# Altium project Remote_Control.PrjPcb
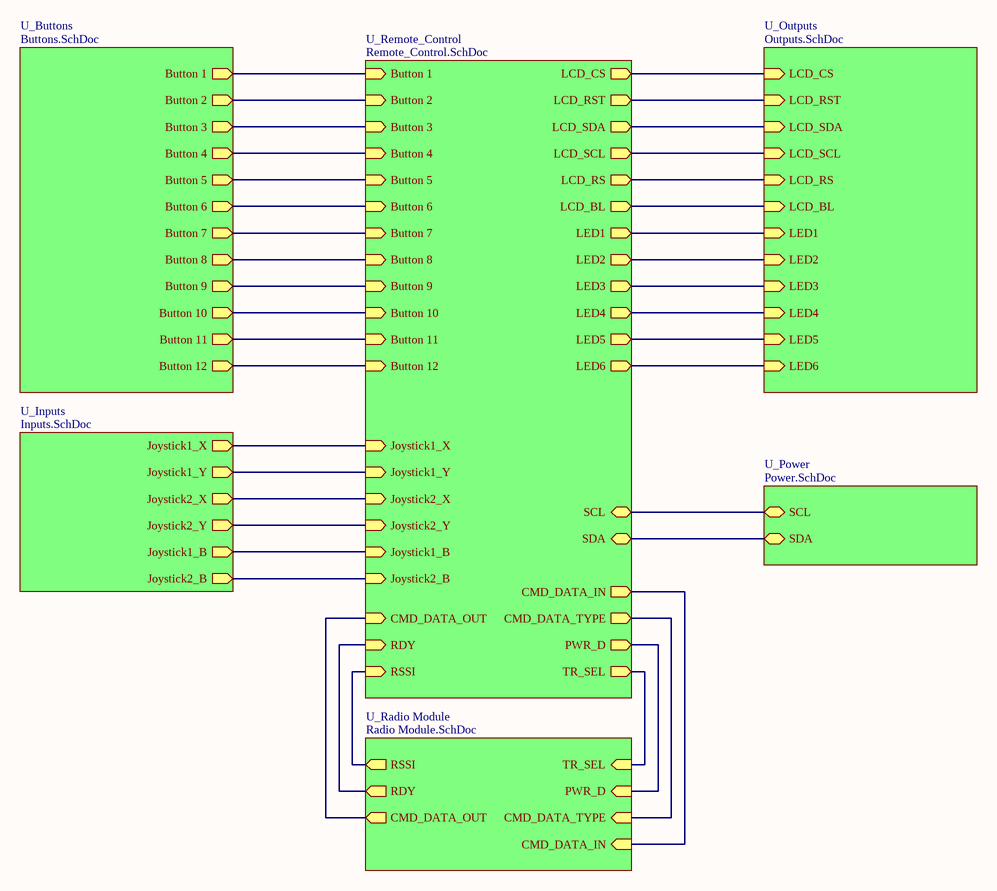
[diagram p0: Remote_Control_Top.SchDoc]
7 sheets, 109 parts. Net scope: hierarchical (ports join the sheet entries above them; power ports are global).
Board files: Remote_Control.PcbDoc, Remote_Control_V2.PcbDoc
Sheets:
  Remote_Control_Top.SchDoc
    U_Buttons = Buttons.SchDoc
    U_Outputs = Outputs.SchDoc
    U_Radio Module = Radio Module.SchDoc
    U_Remote_Control = Remote_Control.SchDoc
    U_Power = Power.SchDoc
    U_Inputs = Inputs.SchDoc

## Sheet Remote_Control_Top.SchDoc
size Letter

### Sub-sheets
U_Buttons = Buttons.SchDoc: Button 1 (out), Button 3 (out), Button 5 (out), Button 2 (out), Button 4 (out), Button 6 (out), Button 7 (out), Button 8 (out), Button 9 (out), Button 10 (out), Button 11 (out), Button 12 (out)
U_Inputs = Inputs.SchDoc: Joystick1_X (out), Joystick1_Y (out), Joystick2_X (out), Joystick2_Y (out), Joystick2_B (out), Joystick1_B (out)
U_Outputs = Outputs.SchDoc: LCD_RS (in), LCD_SCL (in), LCD_SDA (in), LCD_RST (in), LCD_CS (in), LCD_BL (in), LED1 (in), LED2 (in), LED3 (in), LED4 (in), LED5 (in), LED6 (in)
U_Power = Power.SchDoc: SCL (bidir), SDA (bidir)
U_Radio Module = Radio Module.SchDoc: RSSI (out), RDY (out), TR_SEL (in), PWR_D (in), CMD_DATA_TYPE (in), CMD_DATA_OUT (out), CMD_DATA_IN (in)
U_Remote_Control = Remote_Control.SchDoc: Button 1 (in), Button 2 (in), Button 3 (in), Button 4 (in), Button 5 (in), Joystick1_X (in), Joystick1_Y (in), Joystick2_X (in), Joystick2_Y (in), Button 6 (in), LCD_CS (out), LCD_RST (out), LCD_SDA (out), LCD_SCL (out), LCD_RS (out), LCD_BL (out), LED1 (out), LED2 (out), LED3 (out), LED4 (out), LED5 (out), LED6 (out), Button 7 (in), Button 8 (in), Button 9 (in), Button 10 (in), Button 11 (in), Button 12 (in), RSSI (in), CMD_DATA_IN (out), CMD_DATA_OUT (in), CMD_DATA_TYPE (out), PWR_D (out), TR_SEL (out), RDY (in), SDA (bidir), SCL (bidir), Joystick1_B (in), Joystick2_B (in)

### Nets
EXSCL: sheet U_Remote_Control/SCL, sheet U_Power/SCL
EXSDA: sheet U_Remote_Control/SDA, sheet U_Power/SDA
NetC2_1: sheet U_Remote_Control/Joystick1_B, sheet U_Inputs/Joystick1_B
NetC3_1: sheet U_Remote_Control/Joystick2_B, sheet U_Inputs/Joystick2_B
NetC6_1: sheet U_Buttons/Button 2, sheet U_Remote_Control/Button 2
NetC12_1: sheet U_Buttons/Button 3, sheet U_Remote_Control/Button 3
NetC13_1: sheet U_Buttons/Button 4, sheet U_Remote_Control/Button 4
NetC14_1: sheet U_Buttons/Button 5, sheet U_Remote_Control/Button 5
NetC15_1: sheet U_Buttons/Button 11, sheet U_Remote_Control/Button 11
NetC16_1: sheet U_Buttons/Button 6, sheet U_Remote_Control/Button 6
NetC17_1: sheet U_Buttons/Button 7, sheet U_Remote_Control/Button 7
NetC18_1: sheet U_Buttons/Button 8, sheet U_Remote_Control/Button 8
NetC20_1: sheet U_Buttons/Button 9, sheet U_Remote_Control/Button 9
NetC21_1: sheet U_Buttons/Button 10, sheet U_Remote_Control/Button 10
NetC22_1: sheet U_Buttons/Button 12, sheet U_Remote_Control/Button 12
NetC23_1: sheet U_Buttons/Button 1, sheet U_Remote_Control/Button 1
NetR1_1: sheet U_Outputs/LED1, sheet U_Remote_Control/LED1
NetR2_1: sheet U_Outputs/LED2, sheet U_Remote_Control/LED2
NetR3_1: sheet U_Outputs/LED3, sheet U_Remote_Control/LED3
NetR5_1: sheet U_Outputs/LED4, sheet U_Remote_Control/LED4
NetR6_1: sheet U_Outputs/LED5, sheet U_Remote_Control/LED5
NetR7_1: sheet U_Outputs/LED6, sheet U_Remote_Control/LED6
NetR9_1: sheet U_Outputs/LCD_RST, sheet U_Remote_Control/LCD_RST
NetR11_1: sheet U_Outputs/LCD_BL, sheet U_Remote_Control/LCD_BL
NetU1_1: sheet U_Remote_Control/Joystick1_X, sheet U_Inputs/Joystick1_X
NetU1_6: sheet U_Remote_Control/Joystick1_Y, sheet U_Inputs/Joystick1_Y
NetU1_8: sheet U_Remote_Control/Joystick2_X, sheet U_Inputs/Joystick2_X
NetU1_13: sheet U_Remote_Control/Joystick2_Y, sheet U_Inputs/Joystick2_Y
NetU2_14: sheet U_Radio Module/RSSI, sheet U_Remote_Control/RSSI
NetU2_17: sheet U_Radio Module/PWR_D, sheet U_Remote_Control/PWR_D
NetU2_18: sheet U_Outputs/LCD_CS, sheet U_Remote_Control/LCD_CS
NetU2_20: sheet U_Outputs/LCD_RS, sheet U_Remote_Control/LCD_RS
NetU2_21: sheet U_Radio Module/TR_SEL, sheet U_Remote_Control/TR_SEL
NetU2_22: sheet U_Radio Module/RDY, sheet U_Remote_Control/RDY
NetU2_31: sheet U_Radio Module/CMD_DATA_OUT, sheet U_Remote_Control/CMD_DATA_OUT
NetU2_39: sheet U_Outputs/LCD_SCL, sheet U_Remote_Control/LCD_SCL
NetU2_41: sheet U_Outputs/LCD_SDA, sheet U_Remote_Control/LCD_SDA
NetU2_42: sheet U_Radio Module/CMD_DATA_IN, sheet U_Remote_Control/CMD_DATA_IN
NetU2_43: sheet U_Radio Module/CMD_DATA_TYPE, sheet U_Remote_Control/CMD_DATA_TYPE

## Sheet Buttons.SchDoc
size Letter
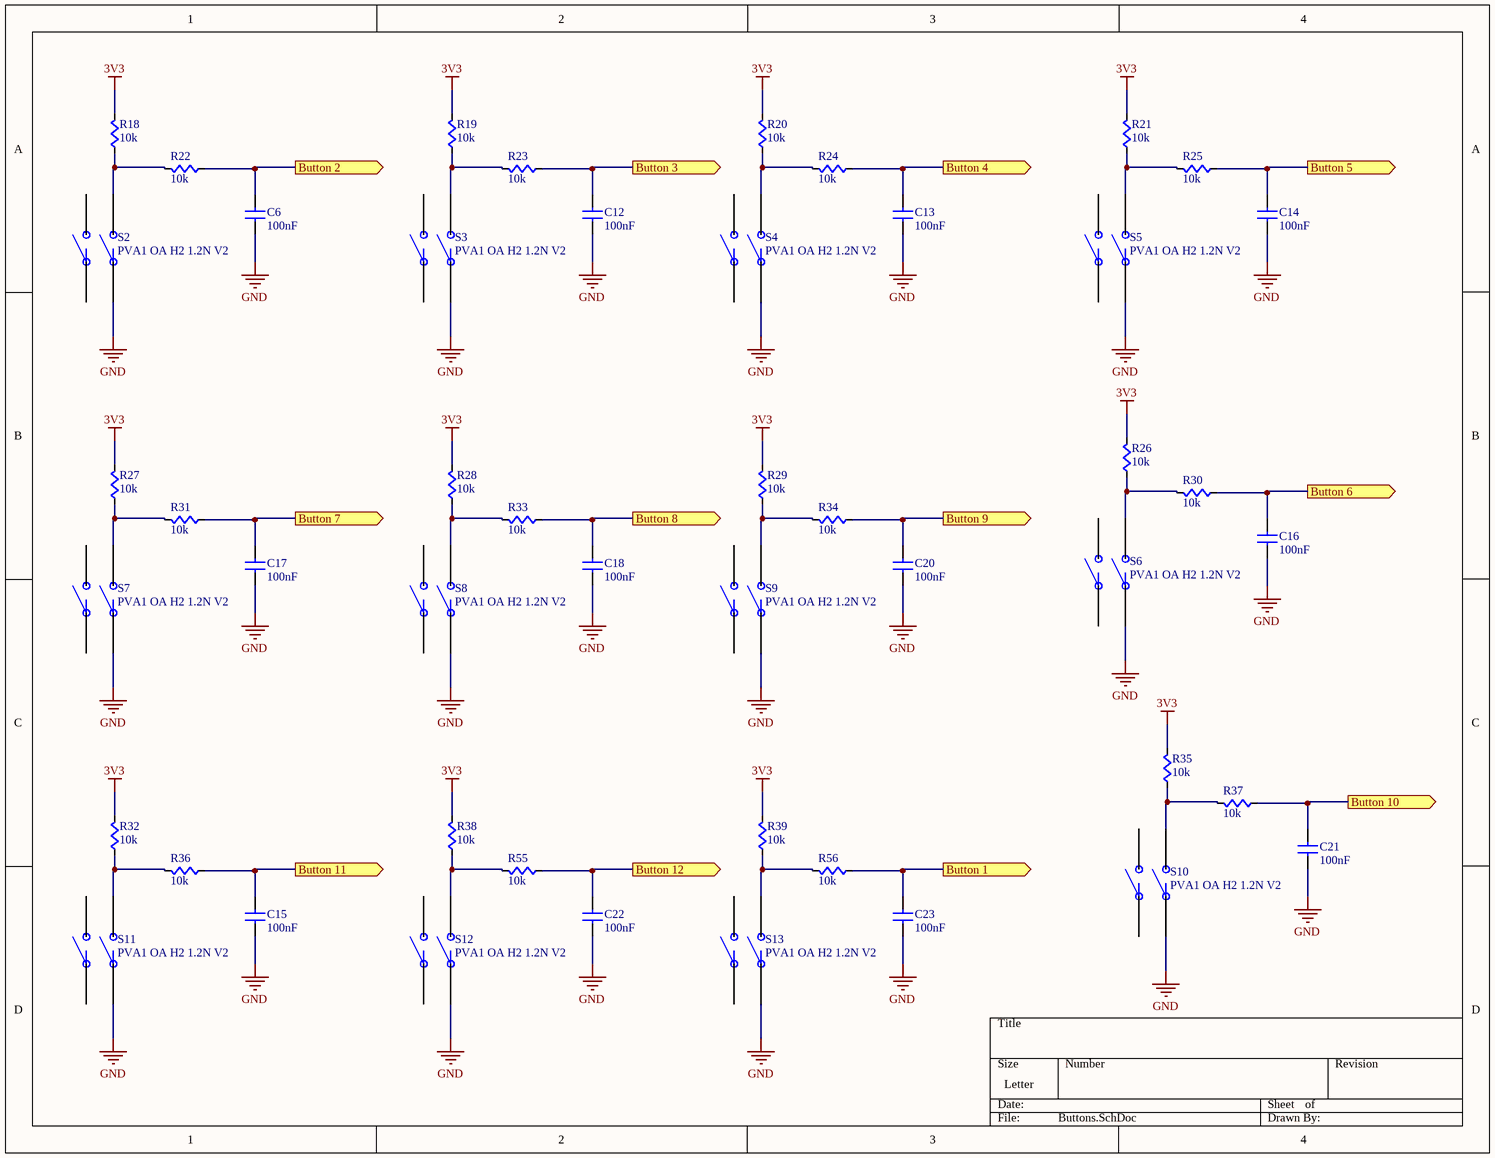
[diagram p1: Buttons.SchDoc]

### Parts
C6  value 100nF  [CAPC0603]  (hidden comment: Cap)
C12  value 100nF  [CAPC0603]  (hidden comment: Cap)
C13  value 100nF  [CAPC0603]  (hidden comment: Cap)
C14  value 100nF  [CAPC0603]  (hidden comment: Cap)
C15  value 100nF  [CAPC0603]  (hidden comment: Cap)
C16  value 100nF  [CAPC0603]  (hidden comment: Cap)
C17  value 100nF  [CAPC0603]  (hidden comment: Cap)
C18  value 100nF  [CAPC0603]  (hidden comment: Cap)
C20  value 100nF  [CAPC0603]  (hidden comment: Cap)
C21  value 100nF  [CAPC0603]  (hidden comment: Cap)
C22  value 100nF  [CAPC0603]  (hidden comment: Cap)
C23  value 100nF  [CAPC0603]  (hidden comment: Cap)
R18  value 10k  [RES0603]  (hidden comment: Res)
R19  value 10k  [RES0603]  (hidden comment: Res)
R20  value 10k  [RES0603]  (hidden comment: Res)
R21  value 10k  [RES0603]  (hidden comment: Res)
R22  value 10k  [RES0603]  (hidden comment: Res)
R23  value 10k  [RES0603]  (hidden comment: Res)
R24  value 10k  [RES0603]  (hidden comment: Res)
R25  value 10k  [RES0603]  (hidden comment: Res)
R26  value 10k  [RES0603]  (hidden comment: Res)
R27  value 10k  [RES0603]  (hidden comment: Res)
R28  value 10k  [RES0603]  (hidden comment: Res)
R29  value 10k  [RES0603]  (hidden comment: Res)
R30  value 10k  [RES0603]  (hidden comment: Res)
R31  value 10k  [RES0603]  (hidden comment: Res)
R32  value 10k  [RES0603]  (hidden comment: Res)
R33  value 10k  [RES0603]  (hidden comment: Res)
R34  value 10k  [RES0603]  (hidden comment: Res)
R35  value 10k  [RES0603]  (hidden comment: Res)
R36  value 10k  [RES0603]  (hidden comment: Res)
R37  value 10k  [RES0603]  (hidden comment: Res)
R38  value 10k  [RES0603]  (hidden comment: Res)
R39  value 10k  [RES0603]  (hidden comment: Res)
R55  value 10k  [RES0603]  (hidden comment: Res)
R56  value 10k  [RES0603]  (hidden comment: Res)
S2  PVA1 OA H2 1.2N V2  [PVA1 OA H2 1.2N V2]
S3  PVA1 OA H2 1.2N V2  [PVA1 OA H2 1.2N V2]
S4  PVA1 OA H2 1.2N V2  [PVA1 OA H2 1.2N V2]
S5  PVA1 OA H2 1.2N V2  [PVA1 OA H2 1.2N V2]
S6  PVA1 OA H2 1.2N V2  [PVA1 OA H2 1.2N V2]
S7  PVA1 OA H2 1.2N V2  [PVA1 OA H2 1.2N V2]
S8  PVA1 OA H2 1.2N V2  [PVA1 OA H2 1.2N V2]
S9  PVA1 OA H2 1.2N V2  [PVA1 OA H2 1.2N V2]
S10  PVA1 OA H2 1.2N V2  [PVA1 OA H2 1.2N V2]
S11  PVA1 OA H2 1.2N V2  [PVA1 OA H2 1.2N V2]
S12  PVA1 OA H2 1.2N V2  [PVA1 OA H2 1.2N V2]
S13  PVA1 OA H2 1.2N V2  [PVA1 OA H2 1.2N V2]

### Ports
Button 1 (out), Button 2 (out), Button 3 (out), Button 4 (out), Button 5 (out), Button 6 (out), Button 7 (out), Button 8 (out), Button 9 (out), Button 10 (out), Button 11 (out), Button 12 (out)

### Nets
3V3: R18.1(A) R19.1(A) R20.1(A) R21.1(A) R26.1(A) R27.1(A) R28.1(A) R29.1(A) R32.1(A) R35.1(A) R38.1(A) R39.1(A)
GND: C6.2(B) C12.2(B) C13.2(B) C14.2(B) C15.2(B) C16.2(B) C17.2(B) C18.2(B) C20.2(B) C21.2(B) C22.2(B) C23.2(B) S2.3 S3.3 S4.3 S5.3 S6.3 S7.3 S8.3 S9.3 S10.3 S11.3 S12.3 S13.3
NetC6_1: C6.1(A) R22.2(B) ; port Button 2
NetC12_1: C12.1(A) R23.2(B) ; port Button 3
NetC13_1: C13.1(A) R24.2(B) ; port Button 4
NetC14_1: C14.1(A) R25.2(B) ; port Button 5
NetC15_1: C15.1(A) R36.2(B) ; port Button 11
NetC16_1: C16.1(A) R30.2(B) ; port Button 6
NetC17_1: C17.1(A) R31.2(B) ; port Button 7
NetC18_1: C18.1(A) R33.2(B) ; port Button 8
NetC20_1: C20.1(A) R34.2(B) ; port Button 9
NetC21_1: C21.1(A) R37.2(B) ; port Button 10
NetC22_1: C22.1(A) R55.2(B) ; port Button 12
NetC23_1: C23.1(A) R56.2(B) ; port Button 1
NetR18_2: R18.2(B) R22.1(A) S2.4
NetR19_2: R19.2(B) R23.1(A) S3.4
NetR20_2: R20.2(B) R24.1(A) S4.4
NetR21_2: R21.2(B) R25.1(A) S5.4
NetR26_2: R26.2(B) R30.1(A) S6.4
NetR27_2: R27.2(B) R31.1(A) S7.4
NetR28_2: R28.2(B) R33.1(A) S8.4
NetR29_2: R29.2(B) R34.1(A) S9.4
NetR32_2: R32.2(B) R36.1(A) S11.4
NetR35_2: R35.2(B) R37.1(A) S10.4
NetR38_2: R38.2(B) R55.1(A) S12.4
NetR39_2: R39.2(B) R56.1(A) S13.4

Not connected (* = marked no-connect by the designer): S2 1 2; S3 1 2; S4 1 2; S5 1 2; S6 1 2; S7 1 2; S8 1 2; S9 1 2; S10 1 2; S11 1 2; S12 1 2; S13 1 2

### Library data of the parts
S2-S13 = PVA1 OA H2 1.2N V2: Pushbutton Switch DPST-NO Keyswitch Through Hole; Manufacturer: C&K; Supplier 1: Digi-Key; Supplier Part Number 1: 401-1135-ND; Manufacturer Part Number: PVA1 OA H2 1.2N V2; ComponentLink1URL: https://www.ckswitches.com/media/1343/pva.pdf; ComponentLink1Description: Datasheet; ComponentLink2URL: *
C6 C12-C18 C20-C23 = Cap: Supplier 1: Digi-Key; Supplier Part Number 1: 1276-1000-1-ND
R18-R39 R55 R56 = Res: Supplier 1: Digi-Key; Supplier Part Number 1: RMCF0603FT10K0CT-ND

## Sheet Outputs.SchDoc
size Letter
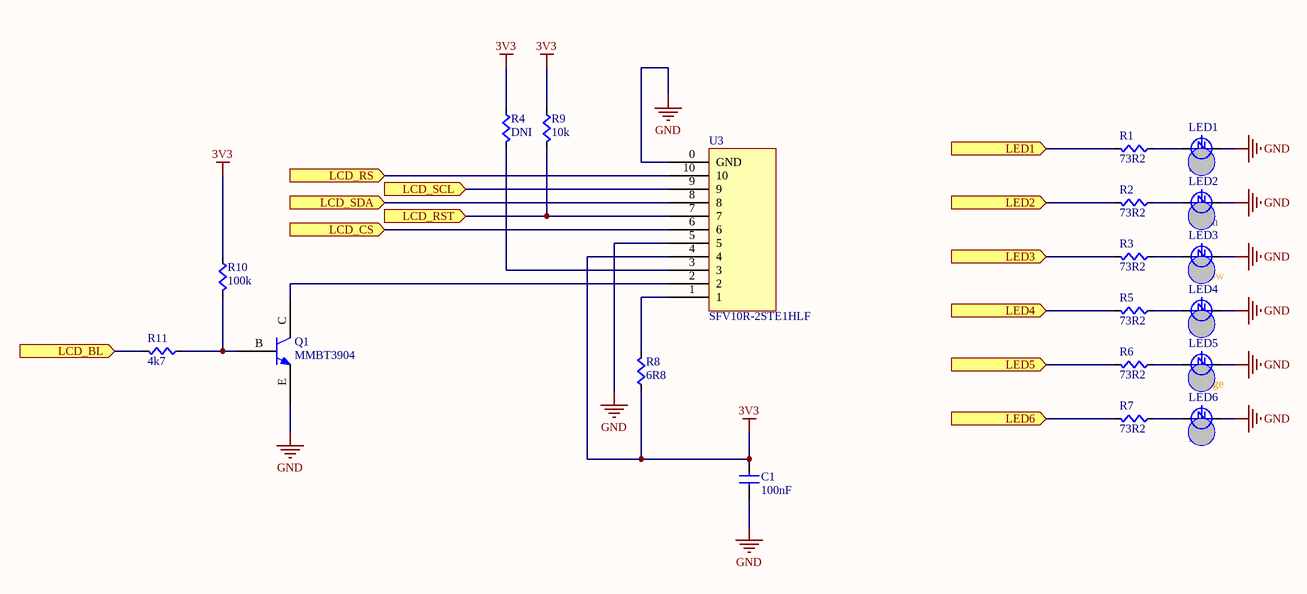
[diagram p2: Outputs.SchDoc]

### Parts
C1  value 100nF  [CAPC0603]  (hidden comment: Cap)
LED1  Color: Red  [LED0603]  (hidden comment: LED)
LED2  Color: Green  [LED0603]  (hidden comment: LED)
LED3  Color: Yellow  [LED0603]  (hidden comment: LED)
LED4  Color: Pink  [LED0603]  (hidden comment: LED)
LED5  Color: Orange  [LED0603]  (hidden comment: LED)
LED6  Color: Blue  [LED0603]  (hidden comment: LED)
Q1  MMBT3904  [MMBT3904]
R1  value 73R2  [RES0603]  (hidden comment: Res)
R2  value 73R2  [RES0603]  (hidden comment: Res)
R3  value 73R2  [RES0603]  (hidden comment: Res)
R4  value DNI  [RES0603]  (hidden comment: Res)
R5  value 73R2  [RES0603]  (hidden comment: Res)
R6  value 73R2  [RES0603]  (hidden comment: Res)
R7  value 73R2  [RES0603]  (hidden comment: Res)
R8  value 6R8  [RES0603]  (hidden comment: Res)
R9  value 10k  [RES0603]  (hidden comment: Res)
R10  value 100k  [RES0603]  (hidden comment: Res)
R11  value 4k7  [RES0603]  (hidden comment: Res)
U3  SFV10R-2STE1HLF  [SFV10R-2STE1HLF]

### Ports
LCD_BL (in), LCD_CS (in), LCD_RS (in), LCD_RST (in), LCD_SCL (in), LCD_SDA (in), LED1 (in), LED2 (in), LED3 (in), LED4 (in), LED5 (in), LED6 (in)

### Nets
3V3: C1.1(A) R4.2(B) R8.2(B) R9.2(B) R10.2(B) U3.4
GND: C1.2(B) LED1.C LED2.C LED3.C LED4.C LED5.C LED6.C Q1.E U3.0(GND) U3.5
NetLED1_A: LED1.A R1.2(B)
NetLED2_A: LED2.A R2.2(B)
NetLED3_A: LED3.A R3.2(B)
NetLED4_A: LED4.A R5.2(B)
NetLED5_A: LED5.A R6.2(B)
NetLED6_A: LED6.A R7.2(B)
NetQ1_B: Q1.B R10.1(A) R11.2(B)
NetQ1_C: Q1.C U3.2
NetR1_1: R1.1(A) ; port LED1
NetR2_1: R2.1(A) ; port LED2
NetR3_1: R3.1(A) ; port LED3
NetR4_1: R4.1(A) U3.3
NetR5_1: R5.1(A) ; port LED4
NetR6_1: R6.1(A) ; port LED5
NetR7_1: R7.1(A) ; port LED6
NetR8_1: R8.1(A) U3.1
NetR9_1: R9.1(A) U3.7 ; port LCD_RST
NetR11_1: R11.1(A) ; port LCD_BL
NetU2_18: U3.6 ; port LCD_CS
NetU2_20: U3.10 ; port LCD_RS
NetU2_39: U3.9 ; port LCD_SCL
NetU2_41: U3.8 ; port LCD_SDA

### Library data of the parts
Q1 = MMBT3904: TRANS NPN 40V 0.2A SOT-23; Manufacturer 1: Fairchild Semiconductor; Supplier 1: Digi-Key; Supplier Part Number 1: MMBT3904FSCT-ND; Manufacturer Part Number 1: MMBT3904
U3 = SFV10R-2STE1HLF: CONN FFC TOP 10POS 0.50MM R/A; Manufacturer 1: Amphenol FCI; Manufacturer Part Number 1: SFV10R-2STE1HLF; Supplier Part Number 1: 609-4306-1-ND; Supplier 1: Digi-Key; ComponentLink1URL: https://cdn.amphenol-icc.com/media/wysiwyg/files/drawing/10112793.pdf; ComponentLink1Description: "Datasheet"; ComponentLink2URL: https://www.digikey.com/product-detail/en/amphenol-fci/SFV10R-2STE1HLF/609-4306-1-ND/2626757
C1 = Cap: Supplier 1: Digi-Key; Supplier Part Number 1: 1276-1000-1-ND
LED1-LED6 = LED: Supplier 1: Digi-Key; Supplier Part Number 1: 754-1122-1-ND
R1-R11 = Res: Supplier 1: Digi-Key
  R1-R3 R5-R7: Supplier Part Number 1: RMCF0603FT73R2CT-ND
  R4: Supplier Part Number 1: RMCF0603JT10K0CT-ND
  R8: Supplier Part Number 1: RMCF0603FT6R80CT-ND
  R9: Supplier Part Number 1: RMCF0603FT10K0CT-ND
  R10: Supplier Part Number 1: RMCF0603FG100KCT-ND
  R11: Supplier Part Number 1: RMCF0603FT4K70CT-ND

## Sheet Radio Module.SchDoc
size Letter
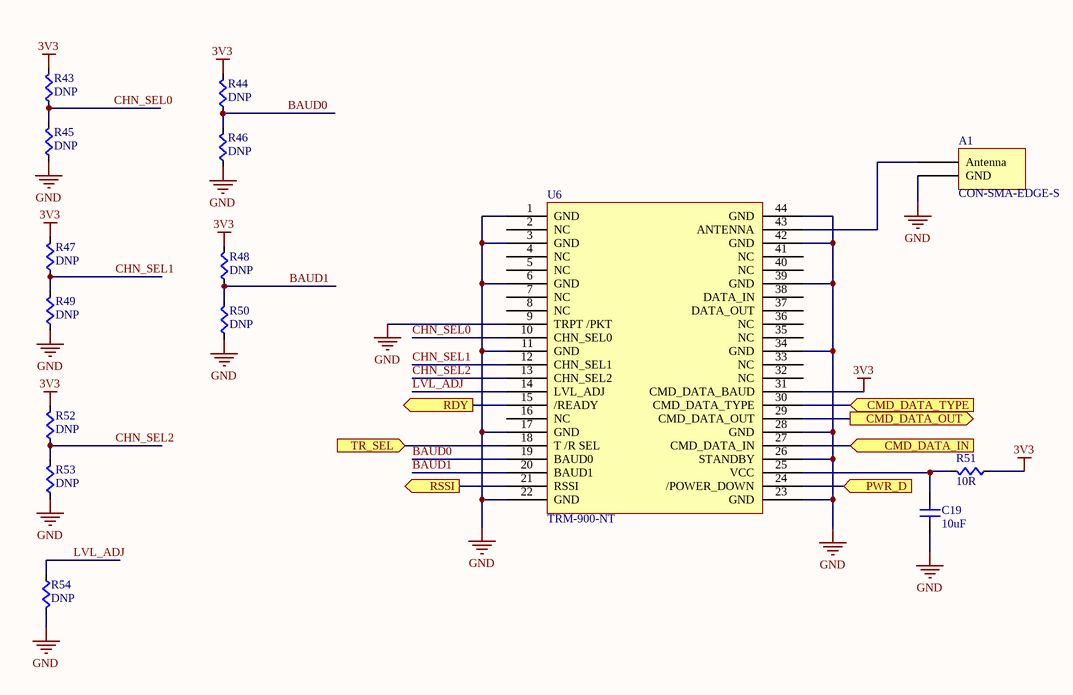
[diagram p3: Radio Module.SchDoc]

### Parts
A1  CON-SMA-EDGE-S  [CON-SMA-EDGE-S]
C19  value 10uF  [CAPC0603]  (hidden comment: Cap)
R43  value DNP  [RES0603]  (hidden comment: Res)
R44  value DNP  [RES0603]  (hidden comment: Res)
R45  value DNP  [RES0603]  (hidden comment: Res)
R46  value DNP  [RES0603]  (hidden comment: Res)
R47  value DNP  [RES0603]  (hidden comment: Res)
R48  value DNP  [RES0603]  (hidden comment: Res)
R49  value DNP  [RES0603]  (hidden comment: Res)
R50  value DNP  [RES0603]  (hidden comment: Res)
R51  value 10R  [RES0603]  (hidden comment: Res)
R52  value DNP  [RES0603]  (hidden comment: Res)
R53  value DNP  [RES0603]  (hidden comment: Res)
R54  value DNP  [RES0603]  (hidden comment: Res)
U6  TRM-900-NT  [TRM-900-NT]

### Ports
CMD_DATA_IN (in), CMD_DATA_OUT (out), CMD_DATA_TYPE (in), PWR_D (in), RDY (out), RSSI (out), TR_SEL (in)

### Nets
3V3: R43.1(A) R44.1(A) R47.1(A) R48.1(A) R51.2(B) R52.1(A) U6.31(CMD_DATA_BAUD)
GND: A1.1(GND) C19.2(B) R45.2(B) R46.2(B) R49.2(B) R50.2(B) R53.2(B) R54.1(A) U6.1(GND) U6.3(GND) U6.6(GND) U6.9(TRPT_/PKT) U6.11(GND) U6.17(GND) U6.22(GND) U6.23(GND) U6.26(STANDBY) U6.28(GND) U6.34(GND) U6.39(GND) U6.42(GND) U6.44(GND)
BAUD0: R44.2(B) R46.1(A) U6.19(BAUD0)
BAUD1: R48.2(B) R50.1(A) U6.20(BAUD1)
CHN_SEL0: R43.2(B) R45.1(A) U6.10(CHN_SEL0)
CHN_SEL1: R47.2(B) R49.1(A) U6.12(CHN_SEL1)
CHN_SEL2: R52.2(B) R53.1(A) U6.13(CHN_SEL2)
LVL_ADJ: R54.2(B) U6.14(LVL_ADJ)
NetA1_0: A1.0(Antenna) U6.43(ANTENNA)
NetC19_1: C19.1(A) R51.1(A) U6.25(VCC)
NetU2_14: U6.21(RSSI) ; port RSSI
NetU2_17: U6.24(/POWER_DOWN) ; port PWR_D
NetU2_21: U6.18(T_/R_SEL) ; port TR_SEL
NetU2_22: U6.15(/READY) ; port RDY
NetU2_31: U6.29(CMD_DATA_OUT) ; port CMD_DATA_OUT
NetU2_42: U6.27(CMD_DATA_IN) ; port CMD_DATA_IN
NetU2_43: U6.30(CMD_DATA_TYPE) ; port CMD_DATA_TYPE

Not connected (* = marked no-connect by the designer): U6 2(NC) 4(NC) 5(NC) 7(NC) 8(NC) 16(NC) 32(NC) 33(NC) 35(NC) 36(NC) 37(DATA_OUT) 38(DATA_IN) 40(NC) 41(NC)

### Library data of the parts
A1 = CON-SMA-EDGE-S: CONN SMA JACK STR EDGE MNT
U6 = TRM-900-NT: RF TXRX MODULE ISM<1GHZ; Manufacturer 1: Linx; Supplier 1: Digi-Key; Supplier Part Number 1: TRM-900-NT-ND; Manufacturer Part Number 1: TRM-900-NT
C19 = Cap: Supplier 1: Digi-Key; Supplier Part Number 1: 1276-1192-1-ND
R43-R54 = Res: Supplier 1: Digi-Key
  R43-R50 R52-R54: Supplier Part Number 1: RMCF0603JT10K0CT-ND
  R51: Supplier Part Number 1: RMCF0603FT10R0CT-ND

## Sheet Remote_Control.SchDoc
size Letter
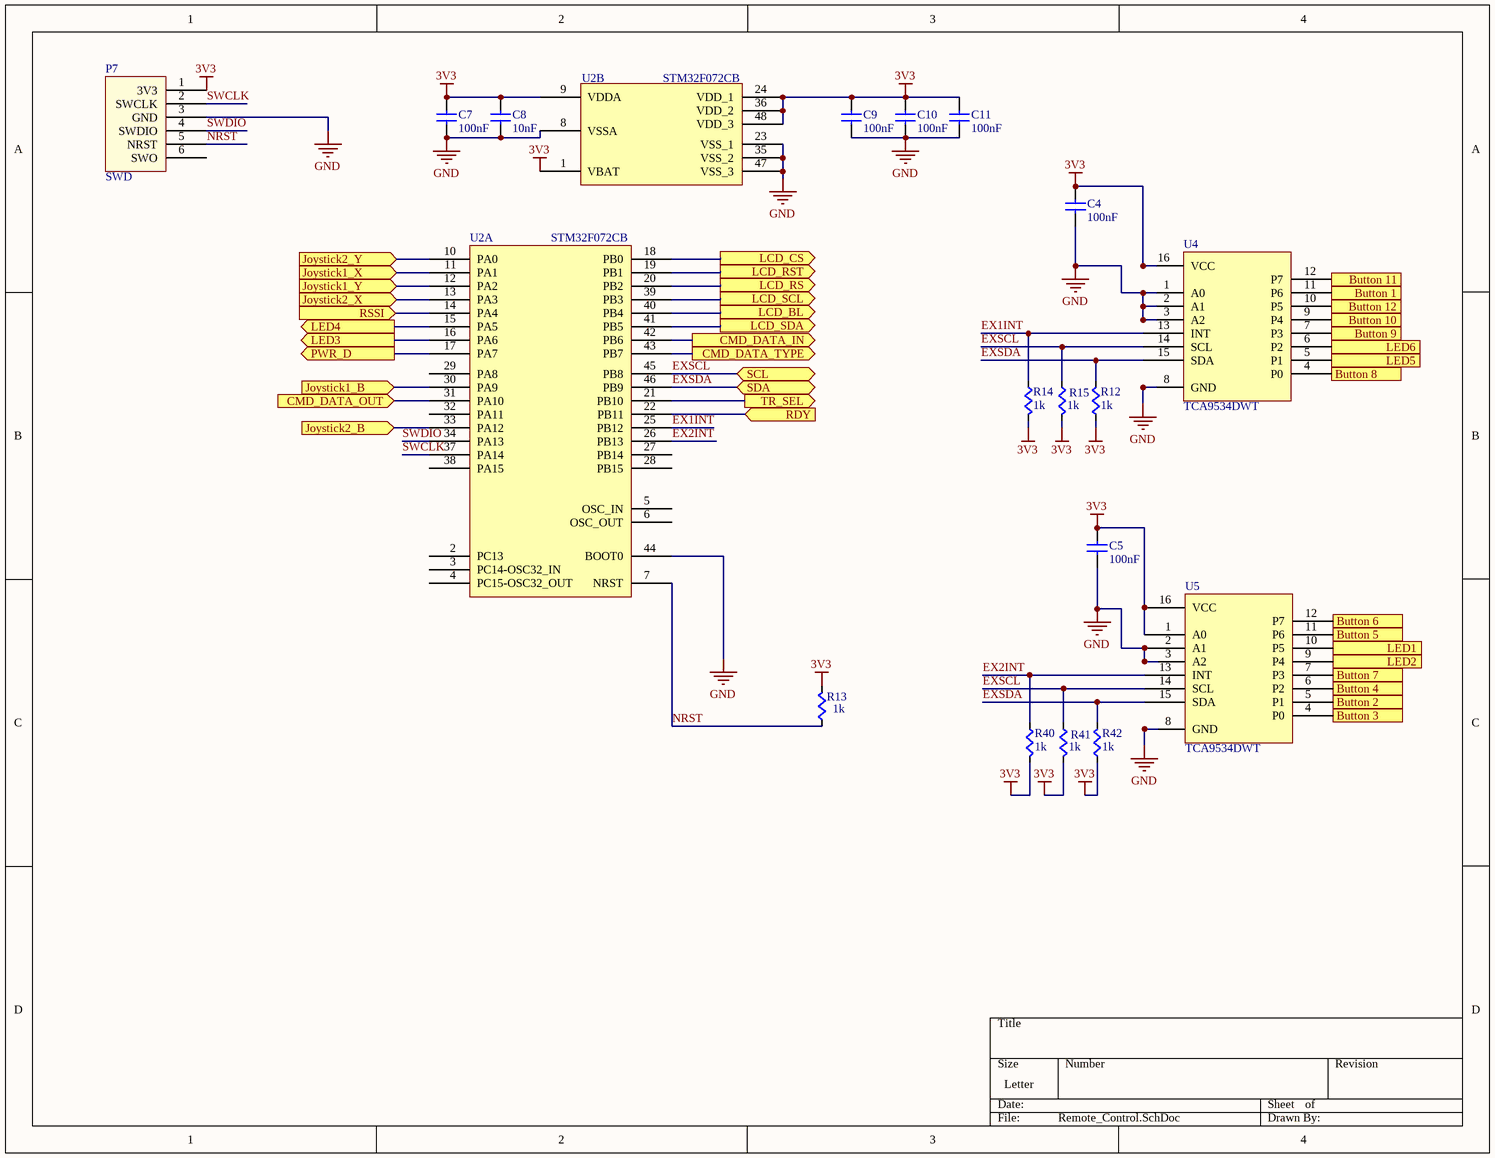
[diagram p4: Remote_Control.SchDoc]

### Parts
C4  value 100nF  [CAPC0603]  (hidden comment: Cap)
C5  value 100nF  [CAPC0603]  (hidden comment: Cap)
C7  value 100nF  [CAPC0603]  (hidden comment: Cap)
C8  value 10nF  [CAPC0603]  (hidden comment: Cap)
C9  value 100nF  [CAPC0603]  (hidden comment: Cap)
C10  value 100nF  [CAPC0603]  (hidden comment: Cap)
C11  value 100nF  [CAPC0603]  (hidden comment: Cap)
P7  SWD  [SWD_STM32]
R12  value 1k  [RES0603]  (hidden comment: Res)
R13  value 1k  [RES0603]  (hidden comment: Res)
R14  value 1k  [RES0603]  (hidden comment: Res)
R15  value 1k  [RES0603]  (hidden comment: Res)
R40  value 1k  [RES0603]  (hidden comment: Res)
R41  value 1k  [RES0603]  (hidden comment: Res)
R42  value 1k  [RES0603]  (hidden comment: Res)
U2  STM32F072CB  [STM32F072CB]  (parts A,B of 2)
U4  TCA9534DWT  [TCA9534DWT]
U5  TCA9534DWT  [TCA9534DWT]

### Ports
Button 1 (in), Button 2 (in), Button 3 (in), Button 4 (in), Button 5 (in), Button 6 (in), Button 7 (in), Button 8 (in), Button 9 (in), Button 10 (in), Button 11 (in), Button 12 (in), CMD_DATA_IN (out), CMD_DATA_OUT (in), CMD_DATA_TYPE (out), Joystick1_B (in), Joystick1_X (in), Joystick1_Y (in), Joystick2_B (in), Joystick2_X (in), Joystick2_Y (in), LCD_BL (out), LCD_CS (out), LCD_RS (out), LCD_RST (out), LCD_SCL (out), LCD_SDA (out), LED1 (out), LED2 (out), LED3 (out), LED4 (out), LED5 (out), LED6 (out), PWR_D (out), RDY (in), RSSI (in), SCL (bidir), SDA (bidir), TR_SEL (out)

### Nets
3V3: C4.1(A) C5.1(A) C7.1(A) C8.1(A) C9.1(A) C10.1(A) C11.1(A) P7.1(3V3) R12.2(B) R13.1(A) R14.1(A) R15.1(A) R40.1(A) R41.1(A) R42.2(B) U2.1(VBAT) U2.9(VDDA) U2.24(VDD_1) U2.36(VDD_2) U2.48(VDD_3) U4.16(VCC) U5.1(A0) U5.16(VCC)
GND: C4.2(B) C5.2(B) C7.2(B) C8.2(B) C9.2(B) C10.2(B) C11.2(B) P7.3(GND) U2.8(VSSA) U2.23(VSS_1) U2.35(VSS_2) U2.44(BOOT0) U2.47(VSS_3) U4.1(A0) U4.2(A1) U4.3(A2) U4.8(GND) U5.2(A1) U5.3(A2) U5.8(GND)
EX1INT: R14.2(B) U2.25(PB12) U4.13(INT)
EX2INT: R40.2(B) U2.26(PB13) U5.13(INT)
EXSCL: R15.2(B) R41.2(B) U2.45(PB8) U4.14(SCL) U5.14(SCL) ; port SCL
EXSDA: R12.1(A) R42.1(A) U2.46(PB9) U4.15(SDA) U5.15(SDA) ; port SDA
NRST: P7.5(NRST) R13.2(B) U2.7(NRST)
SWCLK: P7.2(SWCLK) U2.37(PA14)
SWDIO: P7.4(SWDIO) U2.34(PA13)
NetC2_1: U2.30(PA9) ; port Joystick1_B
NetC3_1: U2.33(PA12) ; port Joystick2_B
NetC6_1: U5.5(P1) ; port Button 2
NetC12_1: U5.4(P0) ; port Button 3
NetC13_1: U5.6(P2) ; port Button 4
NetC14_1: U5.11(P6) ; port Button 5
NetC15_1: U4.12(P7) ; port Button 11
NetC16_1: U5.12(P7) ; port Button 6
NetC17_1: U5.7(P3) ; port Button 7
NetC18_1: U4.4(P0) ; port Button 8
NetC20_1: U4.7(P3) ; port Button 9
NetC21_1: U4.9(P4) ; port Button 10
NetC22_1: U4.10(P5) ; port Button 12
NetC23_1: U4.11(P6) ; port Button 1
NetR1_1: U5.10(P5) ; port LED1
NetR2_1: U5.9(P4) ; port LED2
NetR3_1: U2.16(PA6) ; port LED3
NetR5_1: U2.15(PA5) ; port LED4
NetR6_1: U4.5(P1) ; port LED5
NetR7_1: U4.6(P2) ; port LED6
NetR9_1: U2.19(PB1) ; port LCD_RST
NetR11_1: U2.40(PB4) ; port LCD_BL
NetU1_1: U2.11(PA1) ; port Joystick1_X
NetU1_6: U2.12(PA2) ; port Joystick1_Y
NetU1_8: U2.13(PA3) ; port Joystick2_X
NetU1_13: U2.10(PA0) ; port Joystick2_Y
NetU2_14: U2.14(PA4) ; port RSSI
NetU2_17: U2.17(PA7) ; port PWR_D
NetU2_18: U2.18(PB0) ; port LCD_CS
NetU2_20: U2.20(PB2) ; port LCD_RS
NetU2_21: U2.21(PB10) ; port TR_SEL
NetU2_22: U2.22(PB11) ; port RDY
NetU2_31: U2.31(PA10) ; port CMD_DATA_OUT
NetU2_39: U2.39(PB3) ; port LCD_SCL
NetU2_41: U2.41(PB5) ; port LCD_SDA
NetU2_42: U2.42(PB6) ; port CMD_DATA_IN
NetU2_43: U2.43(PB7) ; port CMD_DATA_TYPE

Not connected (* = marked no-connect by the designer): P7 6(SWO); U2 2(PC13) 3(PC14-OSC32_IN) 4(PC15-OSC32_OUT) 5(OSC_IN) 6(OSC_OUT) 27(PB14) 28(PB15) 29(PA8) 32(PA11) 38(PA15)

### Library data of the parts
P7 = SWD_STM32: SWD connector matching the pinout on STM Discovery Boards
U2 = STM32F072CB: MCU 32BIT 128KB FLASH 48LQFP; Supplier 1: Digi-Key; Supplier Part Number 1: 497-14645-ND
U4 U5 = TCA9534DWT: IC I/O EXPANDER I2C 8B 16-SOIC; Manufacturer 1: Texas Instruments; Supplier 1: Digi-Key; Supplier Part Number 1: 296-45201-1-ND; Manufacturer Part Number 1: TCA9534DWT; ComponentLink1URL: http://www.ti.com/lit/ds/symlink/tca9534.pdf; ComponentLink1Description: Datasheet; ComponentLink2URL: http://www.ti.com/product/TCA9534/technicaldocuments; ComponentLink2Description: Website
C4 C5 C7-C11 = Cap: Supplier 1: Digi-Key
  C4 C5 C7 C9-C11: Supplier Part Number 1: 1276-1000-1-ND
  C8: Supplier Part Number 1: 1276-6841-1-ND
R12-R15 R40-R42 = Res: Supplier 1: Digi-Key
  R12 R14 R15: Supplier Part Number 1: RMCF0603JT10K0CT-ND
  R13 R40-R42: Supplier Part Number 1: RMCF0603FG1K00CT-ND

## Sheet Power.SchDoc
size Letter
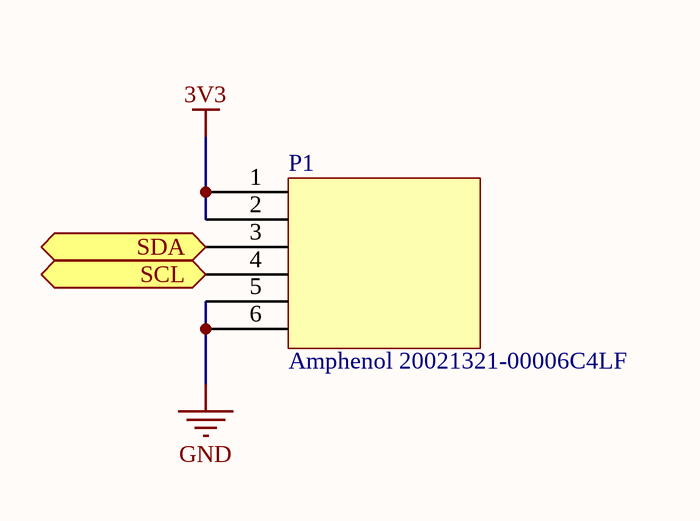
[diagram p5: Power.SchDoc]

### Parts
P1  Amphenol 20021321-00006C4LF  [Amphenol FCI 20021321-00006C4LF - duplicate]

### Ports
SCL (bidir), SDA (bidir)

### Nets
3V3: P1.1 P1.2
GND: P1.5 P1.6
EXSCL: P1.4 ; port SCL
EXSDA: P1.3 ; port SDA

### Library data of the parts
P1 = Amphenol FCI 20021321-00006C4LF: 6 Position Receptacle Connector 0.050" (1.27mm) Surface Mount Gold; Manufacturer 1: Amphenol FCI; Manufacturer Part Number 1: 20021321-00006C4LF; Supplier 1: Digi-Key; Supplier Part Number 1: 609-3704-1-ND; ComponentLink1URL: *; ComponentLink1URL: https://www.digikey.com/product-detail/en/amphenol-fci/20021321-00006C4LF/609-3704-1-ND/2209148; ComponentLink1Description: Website

## Sheet Inputs.SchDoc
size Letter
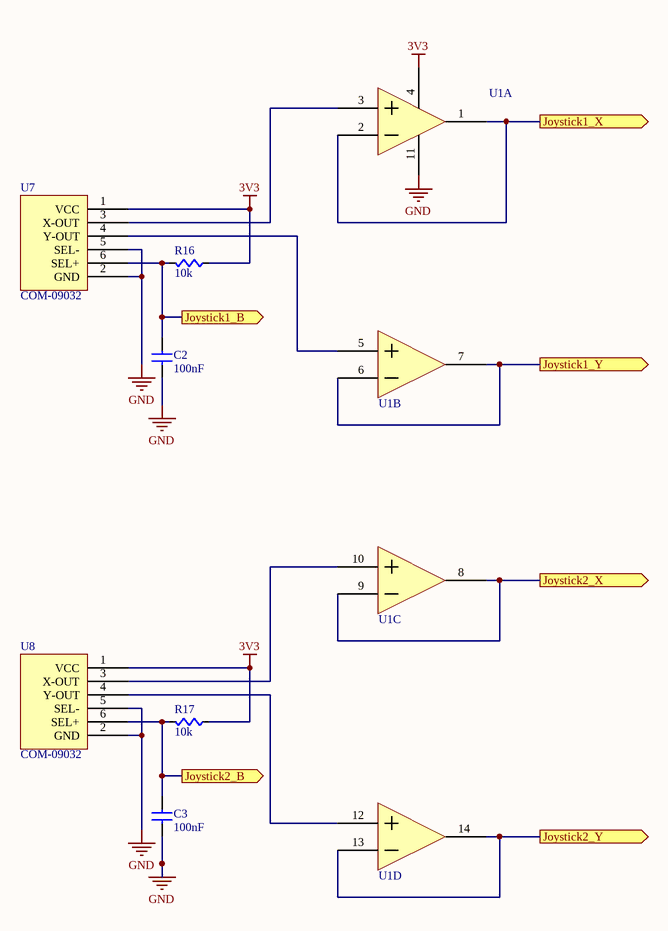
[diagram p6: Inputs.SchDoc]

### Parts
C2  value 100nF  [CAPC0603]  (hidden comment: Cap)
C3  value 100nF  [CAPC0603]  (hidden comment: Cap)
R16  value 10k  [RES0603]  (hidden comment: Res)
R17  value 10k  [RES0603]  (hidden comment: Res)
U1  MCP6L04  [MCP6L04T-E/SL]  (value not drawn)  (parts A,B,C,D of 4)
U7  COM-09032  [Joystick]
U8  COM-09032  [Joystick]

### Ports
Joystick1_B (out), Joystick1_X (out), Joystick1_Y (out), Joystick2_B (out), Joystick2_X (out), Joystick2_Y (out)

### Nets
3V3: R16.2(B) R17.2(B) U1.4(VDD) U7.1(VCC) U8.1(VCC)
GND: C2.2(B) C3.2(B) U1.11(VSS) U7.2(GND) U7.5(SEL-) U8.2(GND) U8.5(SEL-)
NetC2_1: C2.1(A) R16.1(A) U7.6(SEL+) ; port Joystick1_B
NetC3_1: C3.1(A) R17.1(A) U8.6(SEL+) ; port Joystick2_B
NetU1_1: U1.1(VOUTA) U1.2(VINA-) ; port Joystick1_X
NetU1_3: U1.3(VINA+) U7.3(X-OUT)
NetU1_5: U1.5(VINB+) U7.4(Y-OUT)
NetU1_6: U1.6(VINB-) U1.7(VOUTB) ; port Joystick1_Y
NetU1_8: U1.8(VOUTC) U1.9(VINC-) ; port Joystick2_X
NetU1_10: U1.10(VINC+) U8.3(X-OUT)
NetU1_12: U1.12(VIND+) U8.4(Y-OUT)
NetU1_13: U1.13(VIND-) U1.14(VOUTD) ; port Joystick2_Y

### Library data of the parts
U1 = MCP6L04: Quad Op Amp Rail-to-Rail 1Mhz; Supplier 1: Digi-Key
U7 U8 = COM-09032: 2 Axis 10 kOhms Through Hole Joystick Potentiometer; Manufacturer 1: SparkFun Electronics; ComponentLink1: Datasheet; Supplier 1: Digi-Key; Supplier Part Number 1: 1568-1526-ND; Manufacturer Part Number 1: COM-09032; ComponentLink1URL: https://media.digikey.com/pdf/Data%20Sheets/Sparkfun%20PDFs/COM-09032_Web.pdf; ComponentLink2: *; ComponentLink2URL: https://www.sparkfun.com/products/9032
C2 C3 = Cap: Supplier 1: Digi-Key; Supplier Part Number 1: 1276-1000-1-ND
R16 R17 = Res: Supplier 1: Digi-Key; Supplier Part Number 1: RMCF0603FT10K0CT-ND

## Nets that join several sheets
3V3: Buttons (12 pins), Outputs (6 pins), Radio Module (7 pins), Remote_Control (23 pins), Power (P1.1 P1.2), Inputs (5 pins)
GND: Buttons (24 pins), Outputs (10 pins), Radio Module (22 pins), Remote_Control (20 pins), Power (P1.5 P1.6), Inputs (7 pins)
EXSCL: Remote_Control (5 pins), Power (P1.4)
EXSDA: Remote_Control (5 pins), Power (P1.3)
NetC2_1: Remote_Control (U2.30), Inputs (C2.1 R16.1 U7.6)
NetC3_1: Remote_Control (U2.33), Inputs (C3.1 R17.1 U8.6)
NetC6_1: Buttons (C6.1 R22.2), Remote_Control (U5.5)
NetC12_1: Buttons (C12.1 R23.2), Remote_Control (U5.4)
NetC13_1: Buttons (C13.1 R24.2), Remote_Control (U5.6)
NetC14_1: Buttons (C14.1 R25.2), Remote_Control (U5.11)
NetC15_1: Buttons (C15.1 R36.2), Remote_Control (U4.12)
NetC16_1: Buttons (C16.1 R30.2), Remote_Control (U5.12)
NetC17_1: Buttons (C17.1 R31.2), Remote_Control (U5.7)
NetC18_1: Buttons (C18.1 R33.2), Remote_Control (U4.4)
NetC20_1: Buttons (C20.1 R34.2), Remote_Control (U4.7)
NetC21_1: Buttons (C21.1 R37.2), Remote_Control (U4.9)
NetC22_1: Buttons (C22.1 R55.2), Remote_Control (U4.10)
NetC23_1: Buttons (C23.1 R56.2), Remote_Control (U4.11)
NetR1_1: Outputs (R1.1), Remote_Control (U5.10)
NetR2_1: Outputs (R2.1), Remote_Control (U5.9)
NetR3_1: Outputs (R3.1), Remote_Control (U2.16)
NetR5_1: Outputs (R5.1), Remote_Control (U2.15)
NetR6_1: Outputs (R6.1), Remote_Control (U4.5)
NetR7_1: Outputs (R7.1), Remote_Control (U4.6)
NetR9_1: Outputs (R9.1 U3.7), Remote_Control (U2.19)
NetR11_1: Outputs (R11.1), Remote_Control (U2.40)
NetU1_1: Remote_Control (U2.11), Inputs (U1.1 U1.2)
NetU1_6: Remote_Control (U2.12), Inputs (U1.6 U1.7)
NetU1_8: Remote_Control (U2.13), Inputs (U1.8 U1.9)
NetU1_13: Remote_Control (U2.10), Inputs (U1.13 U1.14)
NetU2_14: Radio Module (U6.21), Remote_Control (U2.14)
NetU2_17: Radio Module (U6.24), Remote_Control (U2.17)
NetU2_18: Outputs (U3.6), Remote_Control (U2.18)
NetU2_20: Outputs (U3.10), Remote_Control (U2.20)
NetU2_21: Radio Module (U6.18), Remote_Control (U2.21)
NetU2_22: Radio Module (U6.15), Remote_Control (U2.22)
NetU2_31: Radio Module (U6.29), Remote_Control (U2.31)
NetU2_39: Outputs (U3.9), Remote_Control (U2.39)
NetU2_41: Outputs (U3.8), Remote_Control (U2.41)
NetU2_42: Radio Module (U6.27), Remote_Control (U2.42)
NetU2_43: Radio Module (U6.30), Remote_Control (U2.43)